# EAGLE design vibration_sensor_pcb (EAGLE 9.6.2)
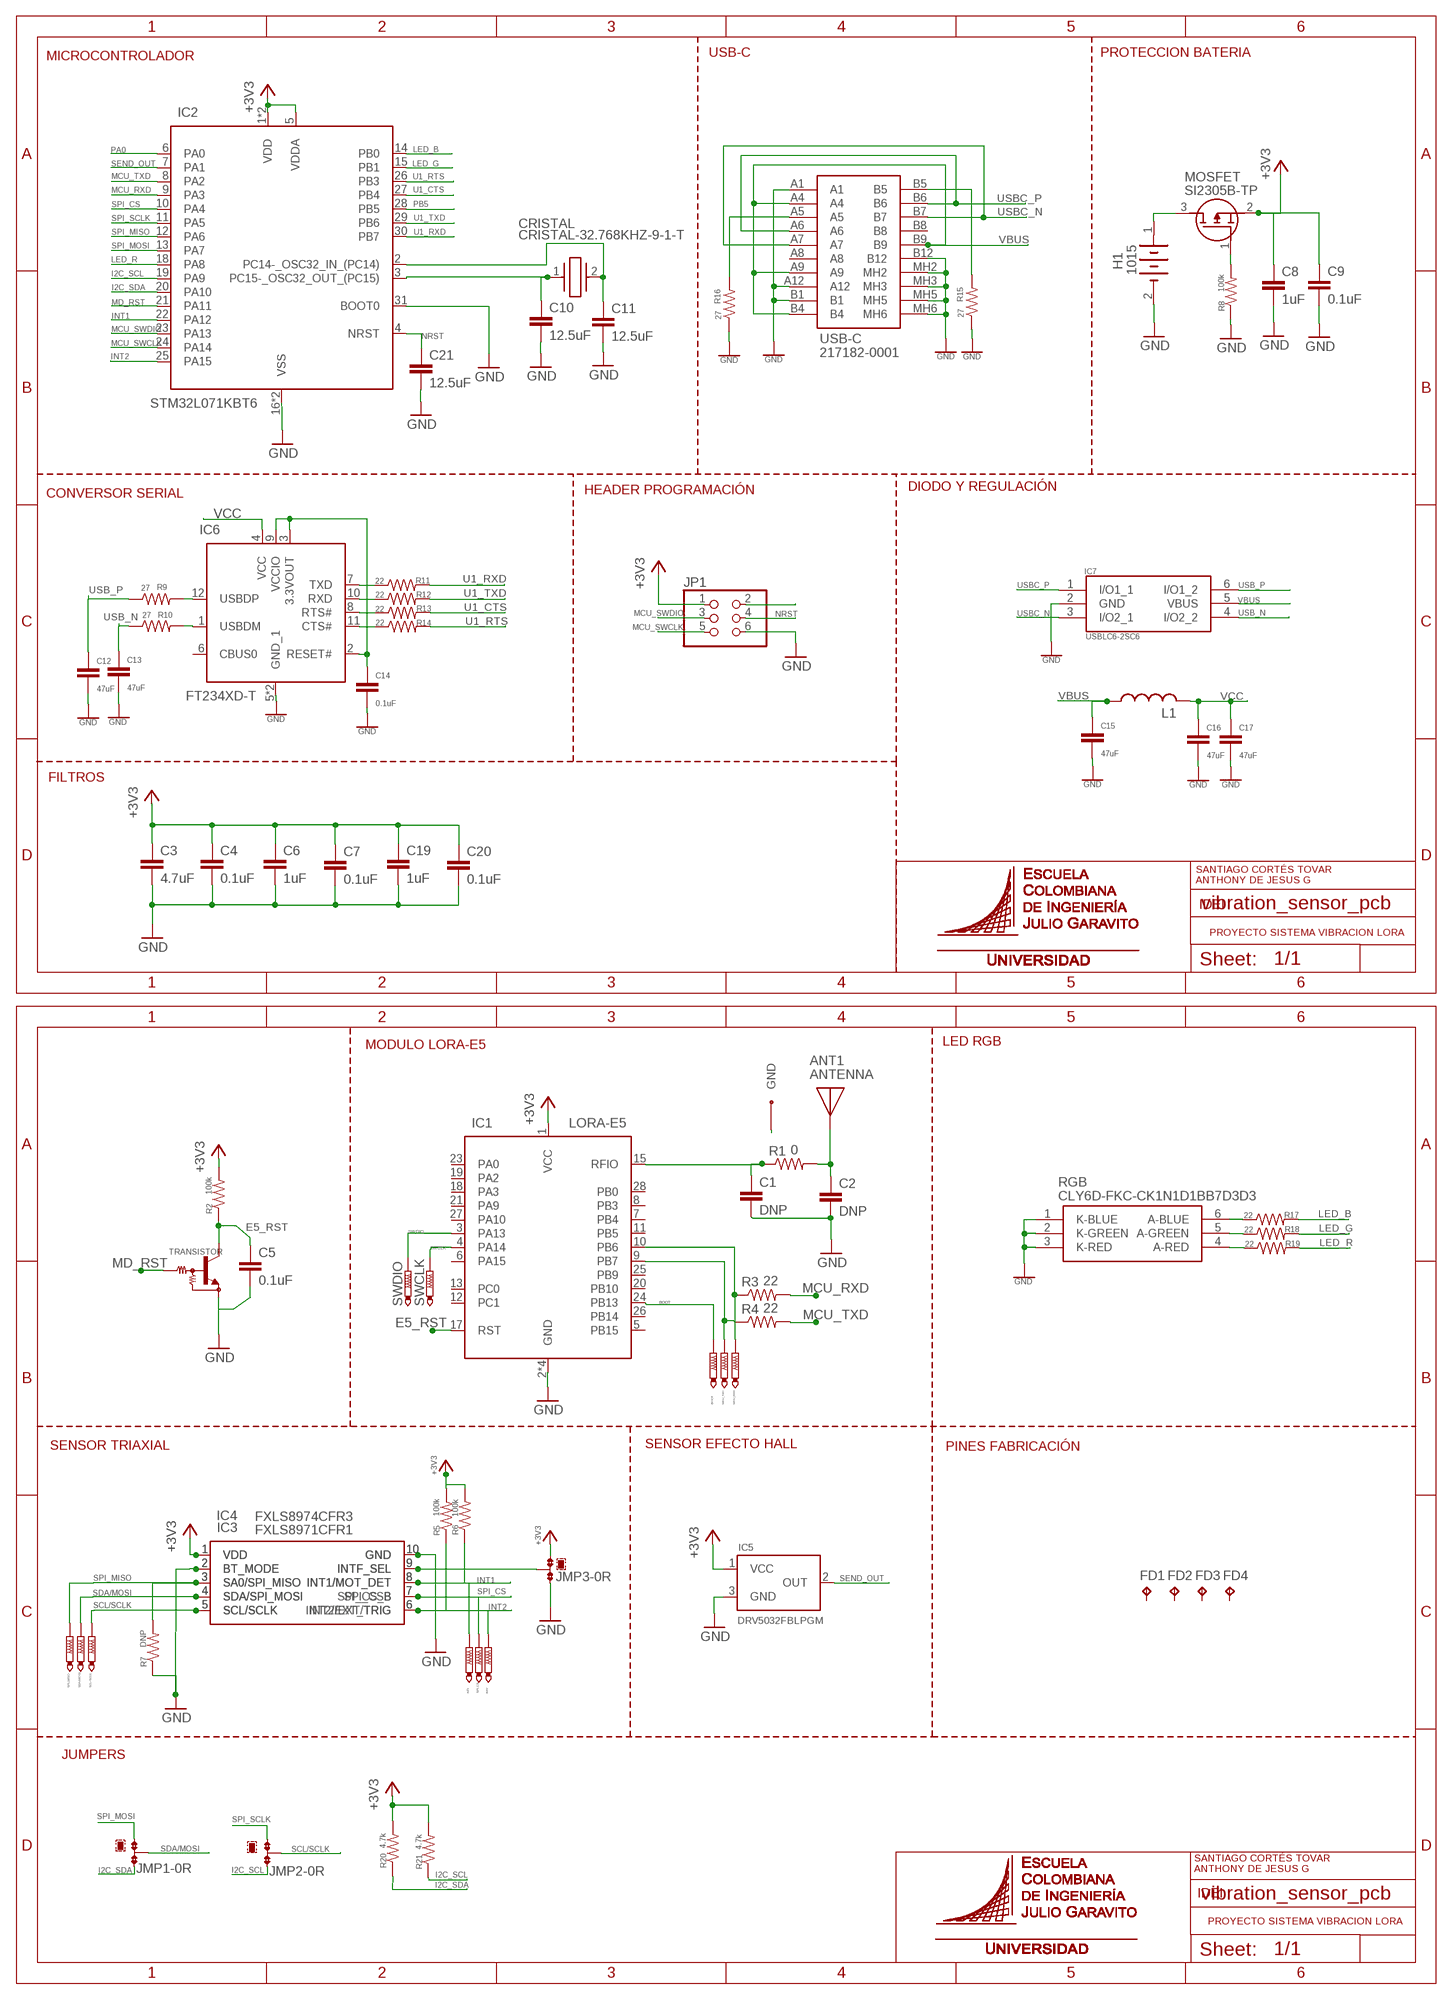
[diagram p0: schematic, sheet 1]

## Parts
ANT1  ANTENNA  [ANTENNA]
BOOT  PTR1TP11R  [TP11R]
C1  DNP  C-EUC0603  [C0603]
C2  DNP  C-EUC0603  [C0603]
C3  4.7uF  C-EUC0603  [C0603]
C4  0.1uF  C-EUC0603  [C0603]
C5  0.1uF  C-EUC0603  [C0603]
C6  1uF  C-EUC0603  [C0603]
C7  0.1uF  C-EUC0603  [C0603]
C8  1uF  C-EUC0603  [C0603]
C9  0.1uF  C-EUC0603  [C0603]
C10  12.5uF  C-EUC0603  [C0603]
C11  12.5uF  C-EUC0603  [C0603]
C12  47uF  C-EUC0603  [C0603]
C13  47uF  C-EUC0603  [C0603]
C14  0.1uF  C-EUC0603  [C0603]
C15  47uF  C-EUC0603  [C0603]
C16  47uF  C-EUC0603  [C0603]
C17  47uF  C-EUC0603  [C0603]
C19  1uF  C-EUC0603  [C0603]
C20  0.1uF  C-EUC0603  [C0603]
C21  12.5uF  C-EUC0603  [C0603]
CRISTAL  CRISTAL-32.768KHZ-9-1-T  [CRISTAL-32.768]
FD1  TPTP10R  [TP10R]
FD2  TPTP10R  [TP10R]
FD3  TPTP10R  [TP10R]
FD4  TPTP10R  [TP10R]
H1  1015  [1015]
IC1  LORA-E5  [LORA-E5]
IC2  STM32L071KBT6  [STM32L071KBT6]
IC3  FXLS8974CFR3  [FXLS8974CFR3]
IC4  FXLS8971CFR1  [FXLS8971CFR1]
IC5  DRV5032FBLPGM  [SOT23]
IC6  FT234XD-T  [SON45P300X300X80-13N]
IC7  USBLC6-2SC6  [SOT95P280X145-6N]
INT1  PTR1TP11R  [TP11R]
INT2  PTR1TP11R  [TP11R]
JMP1  0R-JUMPA  [A0R-JMP]
JMP2  0R-JUMPA  [A0R-JMP]
JMP3  0R-JUMPA  [A0R-JMP]
JP1  PINHD-2X3  [2X03]
L1  L-US  [C0805K]
MCU_RXD  PTR1TP11R  [TP11R]
MCU_TXD  PTR1TP11R  [TP11R]
MOSFET  SI2305B-TP  [SOT95P237X125-3N]
R1  0  R-US_R0603  [R0603]
R2  100k  R-US_R0603  [R0603]
R3  22  R-US_R0603  [R0603]
R4  22  R-US_R0603  [R0603]
R5  100k  R-US_R0603  [R0603]
R6  100k  R-US_R0603  [R0603]
R7  DNP  R-US_R0603  [R0603]
R8  100k  R-US_R0603  [R0603]
R9  27  R-US_R0603  [R0603]
R10  27  R-US_R0603  [R0603]
R11  22  R-US_R0603  [R0603]
R12  22  R-US_R0603  [R0603]
R13  22  R-US_R0603  [R0603]
R14  22  R-US_R0603  [R0603]
R15  27  R-US_R0603  [R0603]
R16  27  R-US_R0603  [R0603]
R17  22  R-US_R0603  [R0603]
R18  22  R-US_R0603  [R0603]
R19  22  R-US_R0603  [R0603]
R20  4.7k  R-US_R0603  [R0603]
R21  4.7k  R-US_R0603  [R0603]
RGB  CLY6D-FKC-CK1N1D1BB7D3D3  [PLCC6]
SCL/SCLK  PTR1TP11R  [TP11R]
SDA/MOSI  PTR1TP11R  [TP11R]
SPI_CS  PTR1TP11R  [TP11R]
SPI_MISO  PTR1TP11R  [TP11R]
SWCLK  PTR1TP11R  [TP11R]
SWDIO  PTR1TP11R  [TP11R]
TRANSISTOR  MUN2211T1-NPN_DRIVER-SC59-BEC  [SC59-BEC]
USB-C  217182-0001  [2171820001]

## Nets
+3V3: C3.1 C4.1 C6.1 C7.1 C8.1 C9.1 C19.1 C20.1 IC1.1(VCC) IC2.1(VDD) IC2.5(VDDA) IC2.17(VDD) IC3.1(VDD) IC4.1(VDD) IC5.1(VCC) JMP3.3 JP1.1 MOSFET.2(S) R2.2 R5.2 R6.2 R20.2 R21.2
A5: R16.2 USB-C.A5
ANT: ANT1.1(FEED) C2.1 R1.2
B5: R15.2 USB-C.B5
BOOT: BOOT.TP IC1.24(PB13)
E5_RST: C5.1 IC1.17(RST) R2.1 TRANSISTOR.C
GATE: MOSFET.1(G) R8.2
GND: ANT1.2(GND) ANT1.3(GND) C1.2 C2.2 C3.2 C4.2 C5.2 C6.2 C7.2 C8.2 C9.2 C10.2 C11.2 C12.2 C13.2 C14.2 C15.2 C16.2 C17.2 C19.2 C21.2 H1.2(-) IC1.2(GND) IC1.14(GND) IC1.16(GND) IC1.22(GND) IC2.16(VSS) IC2.31(BOOT0) IC2.32(VSS) IC3.2(BT_MODE) IC3.10(GND) IC4.2(BT_MODE) IC4.10(GND) IC5.3(GND) IC6.5(GND_1) IC6.13(GND_1) IC7.2(GND) JMP3.1 JP1.6 R7.1 R8.1 R15.1 R16.1 RGB.1(K-BLUE) RGB.2(K-GREEN) RGB.3(K-RED) TRANSISTOR.E USB-C.A1 USB-C.A12 USB-C.B1 USB-C.B12 USB-C.MH2 USB-C.MH3 USB-C.MH5 USB-C.MH6
GND1: C20.2
I2C_SCL: IC2.19(PA9) JMP2.3 R21.1
I2C_SDA: IC2.20(PA10) JMP1.3 R20.1
IN_MOSFET: H1.1(+) MOSFET.3(D)
INT1: IC2.22(PA12) IC3.8(INT1/MOT_DET) IC4.8(INT1/MOT_DET) INT1.TP R6.1
INT2: IC2.25(PA15) IC3.6(INT2/EXT_TRIG) IC4.6(INT2/EXT/TRIG) INT2.TP R5.1
INTF_SEL: IC3.9(INTF_SEL) IC4.9(INTF_SEL) JMP3.2
LED_B: IC2.14(PB0) R17.2
LED_G: IC2.15(PB1) R18.2
LED_R: IC2.18(PA8) R19.2
LORA_RXD: IC1.10(PB6) MCU_RXD.TP R3.1
LORA_TXD: IC1.9(PB7) MCU_TXD.TP R4.1
MCU_RXD: IC2.9(PA3) R3.2
MCU_SWCLK: IC2.24(PA14) JP1.5
MCU_SWDIO: IC2.23(PA13) JP1.3
MCU_TXD: IC2.8(PA2) R4.2
MD_RST: IC2.21(PA11) TRANSISTOR.B
N$2: JP1.2
NRST: C21.1 IC2.4(NRST) JP1.4
OSC32_IN: C11.1 CRISTAL.2 IC2.2(PC14-_OSC32_IN_(PC14))
OSC32_OUT: C10.1 CRISTAL.1 IC2.3(PC15-_OSC32_OUT_(PC15))
OUT_ANT: C1.1 IC1.15(RFIO) R1.1
PA0: IC2.6(PA0)
PB5: IC2.28(PB5)
R11: IC6.7(TXD) R11.1
R12: IC6.10(RXD) R12.1
R13: IC6.8(RTS#) R13.1
R14: IC6.11(CTS#) R14.1
R17: R17.1 RGB.6(A-BLUE)
R18: R18.1 RGB.5(A-GREEN)
R19: R19.1 RGB.4(A-RED)
RESET#: C14.1 IC6.2(RESET#) IC6.3(3.3VOUT) IC6.9(VCCIO)
SCL/SCLK: IC3.5(SCL/SCLK) IC4.5(SCL/SCLK) JMP2.2 SCL/SCLK.TP
SDA/MOSI: IC3.4(SDA/SPI_MOSI) IC4.4(SDA/SPI_MOSI) JMP1.2 SDA/MOSI.TP
SEND_OUT: IC2.7(PA1) IC5.2(OUT)
SPI_CS: IC2.10(PA4) IC3.7(SPI_CS_B) IC4.7(SPI_CSB) SPI_CS.TP
SPI_MISO: IC2.12(PA6) IC3.3(SA0/SPI_MISO) IC4.3(SA0/SPI_MISO) R7.2 SPI_MISO.TP
SPI_MOSI: IC2.13(PA7) JMP1.1
SPI_SCLK: IC2.11(PA5) JMP2.1
SWCLK: IC1.4(PA14) SWCLK.TP
SWDIO: IC1.3(PA13) SWDIO.TP
U1_CTS: IC2.27(PB4) R13.2
U1_RTS: IC2.26(PB3) R14.2
U1_RXD: IC2.30(PB7) R11.2
U1_TXD: IC2.29(PB6) R12.2
USB_N: C13.1 IC7.4(I/O2_2) R10.1
USB_P: C12.1 IC7.6(I/O1_2) R9.1
USBC_N: IC7.3(I/O2_1) USB-C.A7 USB-C.B7
USBC_P: IC7.1(I/O1_1) USB-C.A6 USB-C.B6
USBDM: IC6.1(USBDM) R10.2
USBDP: IC6.12(USBDP) R9.2
VBUS: C15.1 IC7.5(VBUS) L1.1 USB-C.A4 USB-C.A9 USB-C.B4 USB-C.B9
VCC: C16.1 C17.1 IC6.4(VCC) L1.2
Unconnected: FD1.TP FD2.TP FD3.TP FD4.TP IC1.5(PB15) IC1.6(PA15) IC1.7(PB4) IC1.8(PB3) IC1.11(PB5) IC1.12(PC1) IC1.13(PC0) IC1.18(PA3) IC1.19(PA2) IC1.20(PB10) IC1.21(PA9) IC1.23(PA0) IC1.25(PB9) IC1.26(PB14) IC1.27(PA10) IC1.28(PB0) IC6.6(CBUS0) USB-C.A8 USB-C.B8

## Notes on the sheet
- MICROCONTROLADOR | USB-C | PROTECCION BATERIA
- HEADER PROGRAMACIÓN | DIODO Y REGULACIÓN
- CONVERSOR SERIAL
- FILTROS
- SANTIAGO CORTÉS TOVAR
  ANTHONY DE JESUS G
- IDEI
- PROYECTO SISTEMA VIBRACION LORA
- MODULO LORA-E5 | LED RGB
- SENSOR TRIAXIAL | SENSOR EFECTO HALL | PINES FABRICACIÓN
- JUMPERS
- SANTIAGO CORTÉS TOVAR
  ANTHONY DE JESUS G
- IDEI
- PROYECTO SISTEMA VIBRACION LORA

## Library data of the parts
ANT1 = SamacSys_Parts:ANTENNA: PULSE LARSEN ANTENNAS - W3211 - CERAMIC ON GROUND ANTENNA, 902-928MHZ Source: Datasheet; DESCRIPTION: PULSE LARSEN ANTENNAS - W3211 - CERAMIC ON GROUND ANTENNA, 902-928MHZ; HEIGHT: 5mm; MANUFACTURER_NAME: Pulse Electronics; MANUFACTURER_PART_NUMBER: W3211; MOUSER_PART_NUMBER: 673-W3211; MOUSER_PRICE-STOCK: https://www.mouser.co.uk/ProductDetail/PulseLarsen-Antennas/W3211?qs=l7cgNqFNU1g5WBF3n%252BWoMg%3D%3D
BOOT INT1 INT2 MCU_RXD MCU_TXD SCL/SCLK SDA/MOSI SPI_CS SPI_MISO SWCLK SWDIO = testpad:PTR1: TEST PIN
C1-C17 C19-C21 = rcl:C-EU: CAPACITOR, European symbol; SPICEPREFIX: C
CRISTAL = SamacSys_Parts:CRISTAL-32.768KHZ-9-1-T: ABRACON - ABS06-32.768KHZ-9-1-T - CRYSTAL, 32.768KHZ, 9PF, 2 X 1.2MM Source: Datasheet <https://abracon.com/Resonators/ABS06.pdf>; DESCRIPTION: ABRACON - ABS06-32.768KHZ-9-1-T - CRYSTAL, 32.768KHZ, 9PF, 2 X 1.2MM; HEIGHT: 0.6mm; MANUFACTURER_NAME: ABRACON; MANUFACTURER_PART_NUMBER: ABS06-32.768KHZ-9-1-T; MOUSER_PART_NUMBER: 815-ABS06-32.7K-9-T; MOUSER_PRICE-STOCK: https://www.mouser.co.uk/ProductDetail/ABRACON/ABS06-32.768KHZ-9-1-T?qs=3LVMET7lfiNjL9rrGxo%252ByA%3D%3D
FD1-FD4 = testpad:TP: Test pad
H1 = SamacSys_Parts:1015: Cylindrical Battery Contacts, Clips, Holders & Springs AA PC Battery HOLDER Source: Datasheet <https://componentsearchengine.com/Datasheets/1/1015.pdf>; DESCRIPTION: Cylindrical Battery Contacts, Clips, Holders & Springs AA PC Battery HOLDER; HEIGHT: mm; MANUFACTURER_NAME: Keystone Electronics; MANUFACTURER_PART_NUMBER: 1015; MOUSER_PART_NUMBER: 534-1015; MOUSER_PRICE-STOCK: https://www.mouser.co.uk/ProductDetail/Keystone-Electronics/1015?qs=73q%2FgRcW4F2OhJTPPQWZpA%3D%3D
IC1 = SamacSys_Parts:LORA-E5: Sub-GHz Modules LoRa-E5 Wireless Module LoRa-E5 has a 28-pin SMD package Source: Datasheet <https://files.seeedstudio.com/products/317990687/res/LoRa-E5 module datasheet_V1.0.pdf>; DESCRIPTION: Sub-GHz Modules LoRa-E5 Wireless Module LoRa-E5 has a 28-pin SMD package; HEIGHT: 2.5mm; MANUFACTURER_NAME: Seeed Studio; MANUFACTURER_PART_NUMBER: 317990687; MOUSER_PART_NUMBER: 713-317990687; MOUSER_PRICE-STOCK: https://www.mouser.co.uk/ProductDetail/Seeed-Studio/317990687?qs=hd1VzrDQEGhZOj13wvzSLA%3D%3D
IC2 = SamacSys_Parts:STM32L071KBT6: MCU 32-bit STM32 ARM Cortex M0+ RISC 128KB Flash 2.5V/3.3V 32-Pin LQFP Tray Source: Datasheet <https://www.arrow.com/en/products/stm32l071kbt6/stmicroelectronics>; DESCRIPTION: MCU 32-bit STM32 ARM Cortex M0+ RISC 128KB Flash 2.5V/3.3V 32-Pin LQFP Tray; HEIGHT: 1.6mm; MANUFACTURER_NAME: STMicroelectronics; MANUFACTURER_PART_NUMBER: STM32L071KBT6; MOUSER_PART_NUMBER: 511-STM32L071KBT6; MOUSER_PRICE-STOCK: https://www.mouser.co.uk/ProductDetail/STMicroelectronics/STM32L071KBT6?qs=mKNKSX85ZJf5FR8Umx1PEQ%3D%3D
IC3 = SamacSys_Parts:FXLS8974CFR3: Accelerometer X, Y, Z Axis +/-2g, 4g, 8g, 16g 1.6kHz 10-DFN (2x2) Source: Datasheet <https://www.nxp.com/docs/en/data-sheet/FXLS8974CF.pdf>; DESCRIPTION: Accelerometer X, Y, Z Axis +/-2g, 4g, 8g, 16g 1.6kHz 10-DFN (2x2); HEIGHT: 1mm; MANUFACTURER_NAME: NXP; MANUFACTURER_PART_NUMBER: FXLS8974CFR3; MOUSER_PART_NUMBER: 771-FXLS8974CFR3; MOUSER_PRICE-STOCK: https://www.mouser.co.uk/ProductDetail/NXP-Semiconductors/FXLS8974CFR3?qs=QNEnbhJQKva4g7R74%252BwIOg%3D%3D
IC4 = SamacSys_Parts:FXLS8971CFR1: 3-Axis Low-g Accelerometer FXLS8971CF is available in a 3 mm x 3 mm x 1.25 mm 12-pin QFN package with 0.65 mm pitch and wettable flanks Source: Datasheet <https://www.nxp.com/docs/en/data-sheet/FXLS8971CF.pdf>; DESCRIPTION: 3-Axis Low-g Accelerometer FXLS8971CF is available in a 3 mm x 3 mm x 1.25 mm 12-pin QFN package with 0.65 mm pitch and wettable flanks; HEIGHT: 1.3mm; MANUFACTURER_NAME: NXP; MANUFACTURER_PART_NUMBER: FXLS8971CF
IC5 = transistor:DRV5032FBLPGM
IC6 = SamacSys_Parts:FT234XD-T: USB Interface IC USB to Basic Serial UART IC Source: Datasheet <https://datasheet.lcsc.com/szlcsc/1811190128_Future-Designs-FT234XD-T_C89606.pdf>; DESCRIPTION: USB Interface IC USB to Basic Serial UART IC; HEIGHT: 0.8mm; MANUFACTURER_NAME: FTDI(Future Designs); MANUFACTURER_PART_NUMBER: FT234XD-T
IC7 = SamacSys_Parts:USBLC6-2SC6: TVS Diode Array Uni-Directional USBLC6-2SC6 17V, SOT-23 6-Pin Source: Datasheet <http://www.st.com/st-web-ui/static/active/en/resource/technical/document/datasheet/CD00050750.pdf>; DESCRIPTION: TVS Diode Array Uni-Directional USBLC6-2SC6 17V, SOT-23 6-Pin; HEIGHT: 1.45mm; MANUFACTURER_NAME: STMicroelectronics; MANUFACTURER_PART_NUMBER: USBLC6-2SC6; MOUSER_PART_NUMBER: 511-USBLC6-2SC6; MOUSER_PRICE-STOCK: https://www.mouser.co.uk/ProductDetail/STMicroelectronics/USBLC6-2SC6?qs=po45yt2pPpu%2FhNIlwQdTlg%3D%3D
JMP1-JMP3 = jump-0r-smd:0R-JUMP: SMD 0R 0805 Jumper
JP1 = pinhead:PINHD-2X3: PIN HEADER
L1 = rcl:L-US: INDUCTOR, American symbol
MOSFET = SamacSys_Parts:SI2305B-TP: P-Channel 20 V 4.2A (Tj) 1.4W Surface Mount SOT-23 Source: Datasheet <https://www.mccsemi.com/pdf/Products/SI2305B(SOT-23).pdf>; DESCRIPTION: P-Channel 20 V 4.2A (Tj) 1.4W Surface Mount SOT-23; HEIGHT: 1.25mm; MANUFACTURER_NAME: MCC; MANUFACTURER_PART_NUMBER: SI2305B-TP; MOUSER_PART_NUMBER: 833-SI2305B-TP; MOUSER_PRICE-STOCK: https://www.mouser.co.uk/ProductDetail/Micro-Commercial-Components-MCC/SI2305B-TP?qs=55YtniHzbhCFulR5a8ppxA%3D%3D
R1-R21 = rcl:R-US_: RESISTOR, American symbol; SPICEPREFIX: R
RGB = SamacSys_Parts:CLY6D-FKC-CK1N1D1BB7D3D3: LED Blue/Green/Red 6-Pin PLCC T/R Cree CLY6D-FKC-CK1N1D1BB7D3D3, CLY6D-FKC Series RGB LED, 480 (Blue) nm, 540 (Green) nm, 624 (Red) nm PLCC 6 Source: Datasheet <http://www.cree.com/led-components/media/documents/ds-1321-CLY6D-FKC.pdf>; DESCRIPTION: LED Blue/Green/Red 6-Pin PLCC T/R Cree CLY6D-FKC-CK1N1D1BB7D3D3, CLY6D-FKC Series RGB LED, 480 (Blue) nm, 540 (Green) nm, 624 (Red) nm PLCC 6; HEIGHT: mm; MANUFACTURER_NAME: CREE LED; MANUFACTURER_PART_NUMBER: CLY6D-FKC-CK1N1D1BB7D3D3; MOUSER_PART_NUMBER: 941-CLY6DFKCCK1N1D1B; MOUSER_PRICE-STOCK: https://www.mouser.co.uk/ProductDetail/Cree-LED/CLY6D-FKC-CK1N1D1BB7D3D3?qs=3ZbGupGMFUcwV8ee%2FC0TnQ%3D%3D
TRANSISTOR = transistor-neu-to92:*-NPN_DRIVER-: NPN Bias Resistor Transistor; SPICEPREFIX: J
USB-C = SamacSys_Parts:217182-0001: USB-C,VERT SMT,16P 6.40mm HT Source: Datasheet <https://www.molex.com/pdm_docs/sd/2171820001_sd.pdf>; DESCRIPTION: USB-C,VERT SMT,16P 6.40mm HT; HEIGHT: 7.6mm; MANUFACTURER_NAME: Molex; MANUFACTURER_PART_NUMBER: 217182-0001; MOUSER_PART_NUMBER: 538-217182-0001; MOUSER_PRICE-STOCK: https://www.mouser.co.uk/ProductDetail/Molex/217182-0001?qs=DRkmTr78QATos3F5kgk4kw%3D%3D

## Board
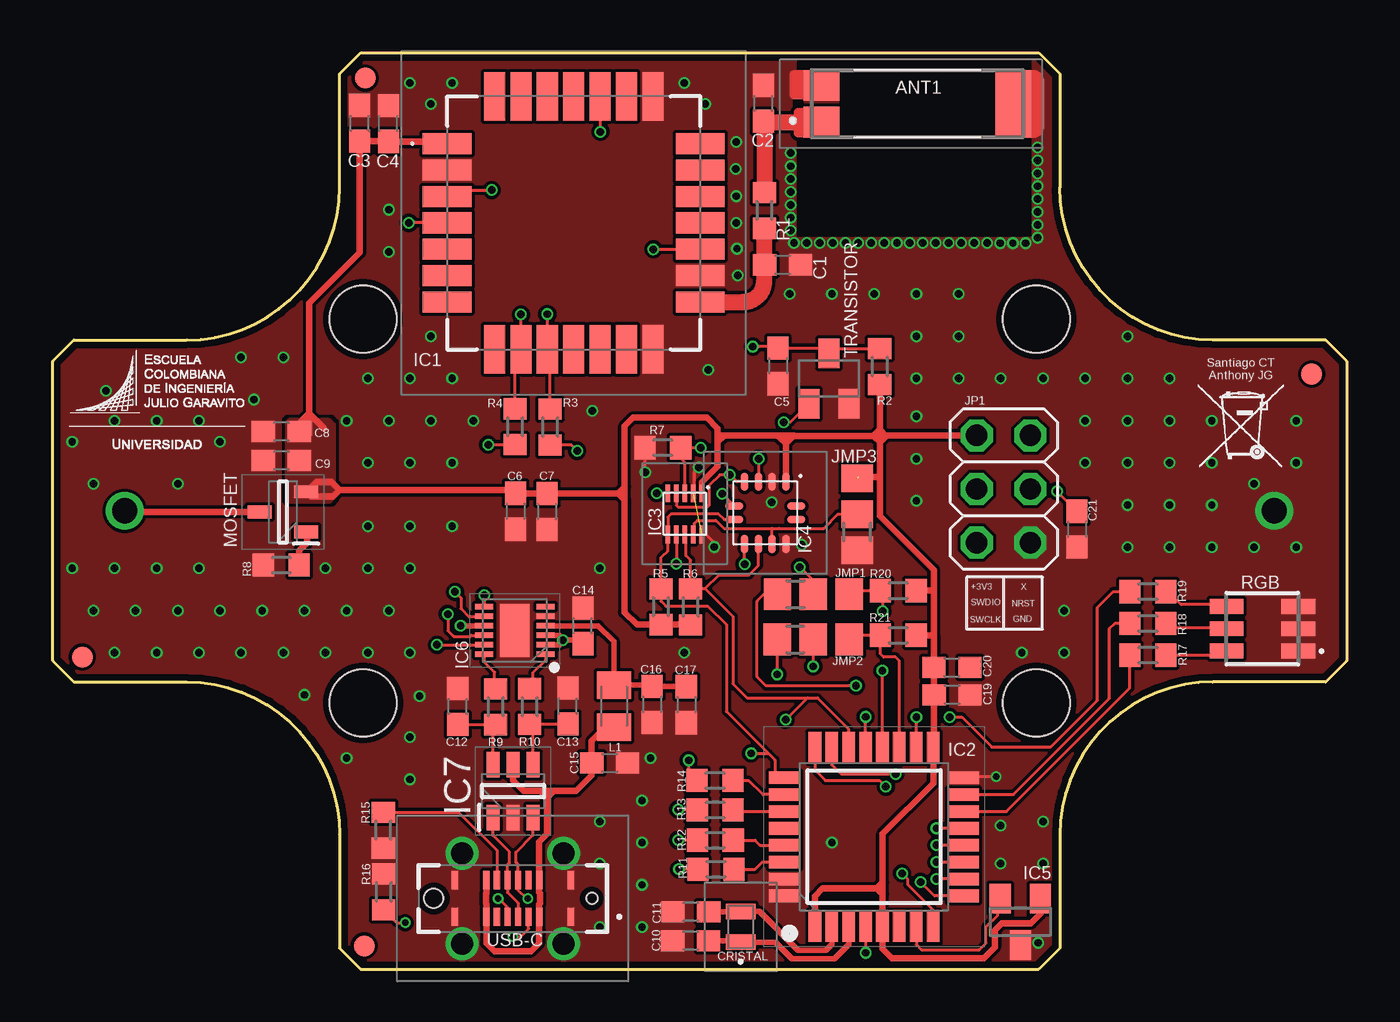
[diagram p1: board, top side]
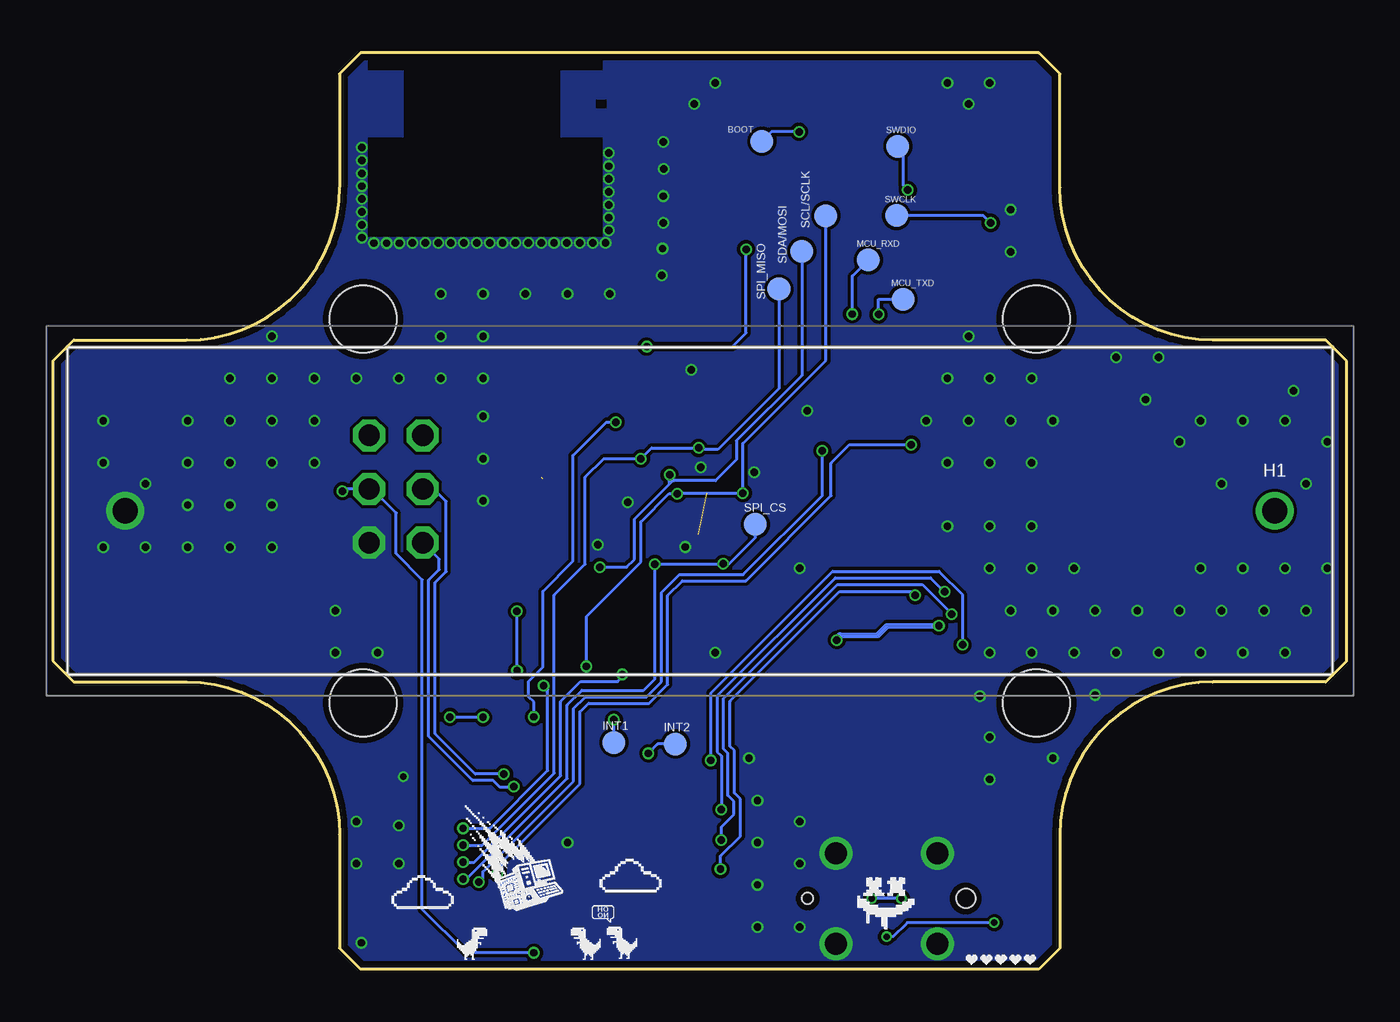
[diagram p2: board, bottom side, seen from below]

Size 61.32 x 43.43 mm. Coordinates in mm from the lower left corner, seen from the top.
Outline: 14.59,43.43 46.73,43.43 47.73,42.43 47.73,37.06 arc90 54.97,29.82 60.32,29.82 61.32,28.82 61.32,14.61 60.32,13.61 54.97,13.61 arc90 47.73,6.38 47.73,1 46.73,0 14.59,0 13.59,1 13.59,6.38 arc90 6.35,13.61 1,13.61 0,14.61 0,28.82 1,29.82 6.35,29.82 arc90 13.59,37.06 13.59,42.43 14.59,43.43
Copper layers (1*16): Top 0.035mm / dielectric 1.5mm / Bottom 0.035mm
Design rules "PCBWay_2L_152um-Track": minimum track width 6mil, minimum drill 0.3mm, track to track 6mil, track to pad 6mil, pad to pad 6mil, via to via 6mil, smd to smd 0mil, copper to edge 0.3mm, drill to drill 10mil, minimum pad ring 6mil, minimum via ring 0.1mm, stop-mask expansion 2mil, vias tented up to drill 0.45mm, thermal gap 0.2mm
Holes 3.17 mm at 14.71,30.81 14.71,12.62 46.61,30.81 46.61,12.62

### Footprints (pad centres in the part's own frame; a part is rotated, then mirrored left to right if it is on the bottom)
ANTENNA = smd 1.7 x 1.45: 1 -4.55,-0.875; 2 -4.55,0.875 | smd 1.7 x 3.2: 3 4.55,0
TP11R = smd 1.1 x 1.1: TP 0,0
C0603 = smd 1.1 x 1: 1 -0.85,0; 2 0.85,0
CRISTAL-32.768 = smd 0.75 x 1.4: 1 -0.725,0; 2 0.725,0
TP10R = smd 1 x 1: TP 0,0
1015 = drill 1.19 pad 1.785: 1 0,0; 2 54.48,0
LORA-E5 = smd 2.3 x 1: 1 -6,3.75; 2 -6,2.5; 3 -6,1.25; 4 -6,0; 5 -6,-1.25; 6 -6,-2.5; 7 -6,-3.75; 15 6,-3.75; 16 6,-2.5; 17 6,-1.25; 18 6,0; 19 6,1.25; 20 6,2.5; 21 6,3.75 | smd 1 x 2.3: 8 -3.75,-6; 9 -2.5,-6; 10 -1.25,-6; 11 0,-6; 12 1.25,-6; 13 2.5,-6; 14 3.75,-6; 22 3.75,6; 23 2.5,6; 24 1.25,6; 25 0,6; 26 -1.25,6; 27 -2.5,6; 28 -3.75,6
STM32L071KBT6 = smd 1.475 x 0.6: 1 -4.238,2.8; 2 -4.238,2; 3 -4.238,1.2; 4 -4.238,0.4; 5 -4.238,-0.4; 6 -4.238,-1.2; 7 -4.238,-2; 8 -4.238,-2.8; 17 4.238,-2.8; 18 4.238,-2; 19 4.238,-1.2; 20 4.238,-0.4; 21 4.238,0.4; 22 4.238,1.2; 23 4.238,2; 24 4.238,2.8 | smd 0.6 x 1.475: 9 -2.8,-4.238; 10 -2,-4.238; 11 -1.2,-4.238; 12 -0.4,-4.238; 13 0.4,-4.238; 14 1.2,-4.238; 15 2,-4.238; 16 2.8,-4.238; 25 2.8,4.238; 26 2,4.238; 27 1.2,4.238; 28 0.4,4.238; 29 -0.4,4.238; 30 -1.2,4.238; 31 -2,4.238; 32 -2.8,4.238
FXLS8974CFR3 = smd 0.85 x 0.225: 1 -0.975,0.8; 2 -0.975,0.4; 3 -0.975,0; 4 -0.975,-0.4; 5 -0.975,-0.8; 6 0.975,-0.8; 7 0.975,-0.4; 8 0.975,0; 9 0.975,0.4; 10 0.975,0.8
FXLS8971CFR1 = smd 0.85 x 0.35: 1 -1.475,0.975; 2 -1.475,0.325; 3 -1.475,-0.325; 4 -1.475,-0.975; 7 1.475,-0.975; 8 1.475,-0.325; 9 1.475,0.325; 10 1.475,0.975 | smd 0.35 x 0.85: 5 -0.325,-1.475; 6 0.325,-1.475; 11 0.325,1.475; 12 -0.325,1.475
SOT23 = smd 1 x 1.4: 1 -0.95,-1.1; 2 0.95,-1.1; 3 0,1.1
SON45P300X300X80-13N = smd 0.85 x 0.25: 1 -1.45,1.125; 2 -1.45,0.675; 3 -1.45,0.225; 4 -1.45,-0.225; 5 -1.45,-0.675; 6 -1.45,-1.125; 7 1.45,-1.125; 8 1.45,-0.675; 9 1.45,-0.225; 10 1.45,0.225; 11 1.45,0.675; 12 1.45,1.125 | smd 1.4 x 2.5: 13 0,0
SOT95P280X145-6N = smd 1.2 x 0.6: 1 -1.25,0.95; 2 -1.25,0; 3 -1.25,-0.95; 4 1.25,-0.95; 5 1.25,0; 6 1.25,0.95
A0R-JMP = smd 1.5 x 1.3: 1 0,1.7; 2 0,0; 3 0,-1.7
2X03 = drill 1.016 octagon: 1 -2.54,-1.27; 2 -2.54,1.27; 3 0,-1.27; 4 0,1.27; 5 2.54,-1.27; 6 2.54,1.27
C0805K = smd 1.3 x 1.6: 1 -1,0; 2 1,0
SOT95P237X125-3N = smd 1.15 x 0.6: 1 -1.1,0.95; 2 -1.1,-0.95; 3 1.1,0
R0603 = smd 1 x 1.1: 1 -0.85,0; 2 0.85,0
PLCC6 = smd 1.6 x 0.7: 1 -1.7,1.05; 2 -1.7,0; 3 -1.7,-1.05; 4 1.7,-1.05; 5 1.7,0; 6 1.7,1.05
SC59-BEC = smd 1 x 1.4: B -0.95,-1.2; C 0,1.2; E 0.95,-1.2
2171820001 = smd 0.3 x 0.87: A1 -2.75,0.865; A4 -1.25,0.865; A5 -0.75,0.865; A6 -0.25,0.865; A7 0.25,0.865; A8 0.75,0.865; A9 1.25,0.865; A12 2.75,0.865; B1 2.75,-0.865; B4 1.25,-0.865; B5 0.75,-0.865; B6 0.25,-0.865; B7 -0.25,-0.865; B8 -0.75,-0.865; B9 -1.25,-0.865; B12 -2.75,-0.865 | drill 1.04 pad 1.56: MH2 -2.4,-2.15; MH3 2.4,-2.15; MH5 2.4,2.15; MH6 -2.4,2.15 | hole 0.52: -3.75,0 | hole 0.89: 3.75,0

### Placement (x,y rotation side)
ANT1  40.97,41.02 0 top
BOOT  27.72,39.24 0 bottom
C1  34.58,33.38 0 top
C2  33.67,41.03 90 top
C3  14.55,40.09 90 top
C4  15.91,40.08 90 top
C5  34.36,28.59 270 top
C6  21.92,21.71 270 top
C7  23.41,21.69 270 top
C8  10.83,25.49 180 top
C9  10.84,24.11 180 top
C10  30.23,1.35 180 top
C11  30.24,2.72 180 top
C12  19.19,12.45 90 top
C13  24.41,12.48 90 top
C14  25.12,16.27 90 top
C15  26.39,9.77 0 top
C16  28.39,12.55 270 top
C17  30.02,12.54 270 top
C19  42.61,13.01 0 top
C20  42.6,14.3 0 top
C21  48.52,20.86 270 top
CRISTAL  32.6,2.01 90 top
FD1  14.81,42.23 0 top
FD2  14.76,1.1 0 top
FD3  1.4,14.79 0 top
FD4  59.65,28.21 0 top
H1  3.41,21.73 180 bottom
IC1  24.69,35.37 0 top
IC2  38.92,6.28 90 top
IC3  29.95,21.58 270 top
IC4  33.76,21.63 270 top
IC5  45.84,2.26 180 top
IC6  21.89,16.05 180 top
IC7  21.81,8.44 90 top
INT1  34.72,10.74 0 bottom
INT2  31.81,10.67 0 bottom
JMP1  36.04,17.78 90 top
JMP2  36.03,15.63 90 top
JMP3  38.12,21.57 180 top
JP1  45.05,22.76 270 top
L1  26.6,12.47 90 top
MCU_RXD  22.67,33.62 0 bottom
MCU_TXD  21.03,31.75 0 bottom
MOSFET  10.91,21.67 180 top
R1  33.72,35.96 90 top
R2  39.18,28.56 270 top
R3  23.57,25.69 270 top
R4  21.91,25.71 270 top
R5  28.82,17.18 270 top
R6  30.22,17.17 270 top
R7  28.91,24.72 0 top
R8  10.83,19.16 0 top
R9  20.99,12.44 90 top
R10  22.6,12.45 90 top
R11  31.42,4.74 0 top
R12  31.39,6.12 0 top
R13  31.39,7.55 0 top
R14  31.38,8.95 0 top
R15  15.66,6.59 90 top
R16  15.68,3.67 270 top
R17  51.89,14.88 180 top
R18  51.89,16.39 180 top
R19  51.89,17.89 180 top
R20  40.06,17.94 0 top
R21  40.06,15.83 0 top
RGB  57.32,16.14 180 top
SCL/SCLK  24.68,35.71 0 bottom
SDA/MOSI  25.82,34.03 0 bottom
SPI_CS  28.02,21.08 0 bottom
SPI_MISO  26.9,32.24 0 bottom
SWCLK  21.34,35.72 0 bottom
SWDIO  21.28,39 0 bottom
TRANSISTOR  36.77,28 0 top
USB-C  21.8,3.35 180 top

### Tracks (layer width: path | path; a pad name or v marks a point on that pad's centre or on a via)
+3V3  (1 unrouted)
  Top 0.152: 39.19,27.76 39.18,27.75 R2.2
  Top 0.254: 12.1,25.49 C8.1 11.68,25.89 12.15,26.36 | 12.15,26.36 12.87,25.64 12.87,25.61 12.15,26.32 12.15,26.36 | IC3.1 30.75,23.07 31.5,23.83 | 34.42,25.23 34.48,25.29 | 39.53,25.3 39.48,25.3 39.19,25.59 38.88,25.28 39.19,24.96 39.53,25.3 | 39.53,25.3
  Top 0.305: IC1.1 18.58,39.23 C4.1 C3.1 14.55,33.97 12.15,31.57 12.15,26.36 12.15,25.34 | 13.6,22.7 13.29,22.39 12.24,22.39 MOSFET.2 12.47,23.09 13.21,23.09 13.59,22.7 13.6,22.7 | 34.74,24.91 IC4.1 | 31.5,25.29 31.5,24.98 | 31.5,24.98 31.5,23.83 | 31.5,25.29 31.5,25.63 30.99,26.14 27.5,26.14 27.1,25.74 27.1,22.86 | 34.74,24.91 34.42,25.23 | 31.82,25.29 34.48,25.29 34.74,25.29 | 31.82,25.29 31.5,25.29 | 31.5,24.98 31.82,25.29 | 34.74,25.29 35.11,25.29 35.1,25.28 | 35.1,25.28 38.88,25.28 | 39.19,27.76 39.19,25.59 39.19,25.3 | 34.74,24.91 35.1,25.28 | 34.74,24.91 34.74,25.29 | 41.74,17.93 41.74,15.83 R21.2 41.74,15.83 41.74,14.31 C20.1 41.75,13.02 C19.1 41.76,10.57 IC2.17 41.73,10.5 41.73,8.82 39.31,6.41 39.31,4.11 | 41.74,17.93 41.74,18.92 39.19,21.48 39.19,23.32 | 39.19,25.3 39.19,24.96 39.19,23.32 | 39.31,3.56 IC2.5 39.31,0.97 39.76,0.53 44.12,0.53 44.64,1.04 44.64,1.84 44.98,2.18 46.35,2.18 46.79,2.62 IC5.1 | 39.31,3.56 39.31,4.11 | IC2.1 36.11,3.47 36.48,3.83 39.04,3.83 | 39.04,3.83 39.31,3.56 | 39.04,3.83 39.31,4.11 | 39.19,25.3 39.53,25.3 JP1.1 | R20.2 41.73,17.94 41.74,17.93 | 38.17,23.32 39.19,23.32 | 13.6,22.7 21.78,22.7 C6.1 23.4,22.56 C7.1 26.78,22.54 | 26.78,22.54 27.1,22.86 | 26.78,22.54 27.08,22.23 | 27.08,22.23 27.08,16.92 27.67,16.33 R5.2 R6.2 | 27.08,22.23 27.1,22.25 27.1,22.86
  pour Top (no thermals): 11.24,22.13 11.07,22.29 11.07,25.94 11.21,26.07 13.11,26.07 13.34,25.84 13.34,22.34 13.14,22.13
A5  (via drill 0.3)
  Top 0.152: R16.2 16.29,2.21 v16.7,2.21 | v21.8,1.54 22.17,1.54 22.55,1.92 USB-C.A5
  Bottom 0.152: v16.7,2.21 18.98,2.21 20.82,2.21 21.49,1.54 v21.8,1.54
ANT
  Top 0.406: ANT1.1 35.9,39.62 35.3,39.62 35.3,40.61 35.6,40.61 35.6,39.88 36.16,39.88 ANT1.1
  Top 0.76: R1.2 33.72,40.14 C2.1 33.72,40.14 ANT1.1
B5
  Top 0.152: R15.2 19.23,7.44 21.05,5.63 USB-C.B5
BOOT  (via drill 0.35)
  Top 0.152: IC1.24 25.94,39.71 v25.95,39.69
  Bottom 0.152: v25.95,39.69 27.26,39.69 BOOT.TP
E5_RST  (via drill 0.35)
  Top 0.152: v28.46,34.12 IC1.17 | v33.17,29.51 34.29,29.51 C5.1 36.53,29.44 TRANSISTOR.C 36.99,29.41 R2.1
  Bottom 0.152: v33.17,29.51 29.1,29.51 28.46,30.15 v28.46,34.12
GATE
  Top 0.305: R8.2 11.68,19.84 12.05,20.21 12.05,20.68 MOSFET.1
GND  (via drill 0.3, 0.35)  (1 unrouted)
  Top 0.152: v28.07,23.56 28.07,24.7 R7.1 | v30.6,23.79 30.39,23.58 30.39,22.6 IC3.2 | IC2.16 43.2,9.13 v44.7,9.13 | IC3.10 30.96,20.61 31.34,20.22 v31.34,20.01
  Top 0.406: ANT1.2 35.95,41.42 35.11,41.42 35.11,42.4 35.13,42.41 35.59,42.41 35.59,41.68 35.57,41.66 35.3,41.66 35.3,42.08 36.23,42.08 ANT1.2
  Top 1.016: 46.47,42.1 46.47,39.91
  other vias: 46.69,1.25 34.07,22.13 35.48,20.12 36.95,34.42 42.92,32 40.92,32 38.92,32 36.92,32 34.92,32 40.92,30 42.92,30 40.92,28 42.92,28 44.92,28 40.92,26.2 46.92,28 48.92,28 50.92,28 52.92,28 52.92,26 50.92,26 48.92,26 48.92,24 50.92,24 52.92,24 11.92,13 13.92,10 25.92,5 27.92,6 28.32,10 27.92,2 36.92,6 40.92,24.2 40.92,22.2 50.92,30 32.45,32.88 32.42,34.15 32.38,35.38 32.38,36.64 32.36,37.92 32.39,39.21 30.92,41 29.92,42 18.92,42 17.92,41 58.92,20 54.92,24 46.93,5 2.92,15 8.92,15 14.92,15 14.92,21 2.52,27.42 9.53,27 13.92,26 25.57,26.46 47.92,15 50.92,22 52.92,22 54.92,22 54.92,20 52.92,20 50.92,20 56.92,20 54.92,26 58.92,26 58.92,24 56.92,23 47.92,17 45.92,15 44.92,5 44.92,6.81 46.93,7 27.92,4 25.92,2 25.92,7 27.92,8 29.92,15 25.92,19 12.92,15 10.92,15 6.92,15 4.92,15 3.92,17 1.92,17 5.92,17 7.92,17 9.92,17 11.92,17 13.92,17 15.92,17 16.92,15 17.38,12.94 16.92,11 16.92,9 16.92,19 14.92,19 12.92,19 16.92,21 18.92,21 14.92,24 16.92,24 18.92,24 15.92,26 17.92,26 19.92,26 2.92,19 0.92,19 4.92,19 6.92,19 1.92,23 5.92,23 0.92,25 7.92,25 2.92,26 4.92,26 6.92,26 8.92,29 10.92,29 14.92,28 16.92,28 18.92,28 17.92,30 15.92,34 15.92,36 16.92,42 46.66,38.94 46.66,38.33 46.66,37.72 46.66,37.11 46.67,36.5 46.67,35.89 46.67,35.28 46.66,34.67 46.1,34.41 45.49,34.41 44.88,34.41 44.27,34.42 43.66,34.42 43.05,34.42 42.44,34.42 41.83,34.42 41.22,34.42 40.61,34.42 40,34.42 39.39,34.42 38.78,34.42 38.17,34.42 37.56,34.42 36.34,34.42 35.73,34.42 35.12,34.42 34.96,35.01 34.96,35.62 34.97,36.23 34.97,36.84 34.97,37.45 34.97,38.06 34.97,38.68 31.05,28.4
  pour Top (rank 6, no thermals): -0.05,0.02 61.38,0.02 61.38,43.97 -0.05,43.97
  pour Bottom (rank 6, no thermals): -0.08,0 61.39,0 61.39,43.33 -0.08,43.33
I2C_SCL
  Top 0.152: IC2.19 40.11,14.62 39.93,14.8 39.36,14.8 39.21,14.95 R21.1 37.93,15.83 JMP2.3
I2C_SDA  (via drill 0.35)
  Top 0.152: IC2.20 v39.31,14.15 | v39.32,16.96 39.32,17.83 R20.1 39,17.94 38.99,17.93 37.89,17.93 JMP1.3
  Bottom 0.152: v39.31,14.15 v39.31,16.95 v39.32,16.96
IN_MOSFET
  Top 0.305: MOSFET.3 3.46,21.67 H1.1
INT1  (via drill 0.35)
  Top 0.152: IC3.8 30.01,20.55 30.01,19.6 30.22,19.38 30.22,18.04 | R6.1 30.22,18.04 | 30.91,18.04 31.57,18.7 33,18.7 33.43,19.13 IC4.8 | 30.22,18.04 30.91,18.04 | 30.91,18.04 32.22,16.73 32.22,13.53 32.89,12.86 35.76,12.86 | 35.76,12.86 36.24,12.86 37.71,11.39 IC2.22 | v34.72,11.82 35.76,12.86
  Bottom 0.152: INT1.TP v34.72,11.82
INT2  (via drill 0.35)
  Top 0.152: IC4.6 31.82,21.3 31.55,21.57 29.29,21.57 29.15,21.43 IC3.6 29.15,19.83 28.82,19.5 R5.1 28.82,17.45 29.06,17.21 31.04,17.21 31.92,16.33 31.92,12.21 33.9,10.23 | IC2.25 34.46,9.08 34.22,9.32 34.22,9.92 33.9,10.23 | v33.09,10.23 33.9,10.23
  Bottom 0.152: INT2.TP 32.65,10.67 v33.09,10.23
INTF_SEL
  Top 0.152: IC3.9 30.41,20.67 30.41,21.13 30.54,21.27 31.43,21.27 31.8,20.9 34.08,20.9 | JMP3.2 37.21,21.57 36.54,20.9 34.43,20.9 34.42,20.9 34.08,20.9 | 34.08,20.9 34.08,20.89 IC4.9
LED_B
  Top 0.152: IC2.14 45.19,7.48 51.04,13.32 R17.2
LED_G
  Top 0.152: IC2.15 45.52,8.28 50.08,12.84 50.08,16.14 50.33,16.39 R18.2
LED_R  (via drill 0.35)
  Top 0.152: IC2.18 v40.91,11.93 v40.92,11.94 | v42.49,11.95 43.08,11.95 44.5,10.53 47.29,10.53 49.5,12.74 49.5,17.15 50.24,17.89 R19.2
  Bottom 0.152: v40.92,11.94 v42.48,11.94 v42.49,11.95
LORA_RXD  (via drill 0.35)
  Top 0.152: R3.1 23.57,29.24 IC1.10 v23.44,31.05 v23.43,31.05
  Bottom 0.152: v23.43,31.05 23.43,32.85 MCU_RXD.TP
LORA_TXD  (via drill 0.35)
  Top 0.152: R4.1 21.91,29.09 IC1.9 v22.19,31.03 v22.18,31.03
  Bottom 0.152: v22.18,31.03 22.18,31.75 MCU_TXD.TP
MCU_RXD  (via drill 0.35)
  Top 0.152: IC2.9 41.79,3.48 v41.12,4.14 | v24.85,24.57 24.58,24.84 R3.2
  Bottom 0.152: v41.12,4.14 40.93,4.33 40.93,4.62 36.64,8.91 36.64,12.35 36.08,12.91 33.19,12.91 32.48,13.62 32.48,17.85 31.62,18.71 28.6,18.71 24.85,22.45 v24.85,24.57
MCU_SWCLK  (via drill 0.35)
  Top 0.152: IC2.24 36.11,9.44 36.61,8.95 39.18,8.95 v39.47,8.65
  Bottom 0.152: v39.47,8.65 40.15,8.65 40.45,8.95 41.42,8.95 43.5,11.02 43.5,18.45 43,18.95 43,19.44 JP1.5
MCU_SWDIO  (via drill 0.35)
  Top 0.152: IC2.23 36.92,9.68 37.35,9.25 v39.93,9.25
  Bottom 0.152: v39.93,9.25 41.29,9.25 43.19,11.15 43.19,18.32 42.67,18.84 42.67,22.17 43.27,22.77 JP1.3
MCU_TXD  (via drill 0.35)
  Top 0.152: IC2.8 41.69,2.06 41.69,2.84 40.52,4.01 40.52,4.26 v40.24,4.54 | v20.63,24.86 R4.2
  Bottom 0.152: v40.24,4.54 40.02,4.76 40.02,5.1 36.33,8.79 36.33,12.2 35.92,12.61 33.06,12.61 32.17,13.5 32.17,17.7 31.48,18.4 28.47,18.4 24.43,22.44 24.43,23.99 23.56,24.86 v20.63,24.86
MD_RST  (via drill 0.35)
  Top 0.152: IC2.21 v38.51,11.96 | v34.64,25.93 34.95,25.93 TRANSISTOR.B
  Bottom 0.152: v38.51,11.96 38.51,12.66 38.76,12.91 38.76,13.65 38.09,14.32 38.09,17.91 36.66,19.34 36.66,24.35 35.08,25.93 v34.64,25.93
NRST  (via drill 0.35)
  Top 0.152: IC2.4 v38.51,0.78 | C21.1 v47.58,22.65 v47.58,22.66
  Bottom 0.152: v38.51,0.78 41.73,0.78 43.8,2.85 43.8,18.46 45.04,19.7 45.04,21.63 46.17,22.76 JP1.4 47.48,22.76 v47.58,22.66
OSC32_IN
  Top 0.254: IC2.2 36.91,1.18 36.64,0.91 35.31,0.91 33.49,2.74 33,2.74 | 33,2.74 CRISTAL.2 | C11.1 32.99,2.72 33,2.74
OSC32_OUT
  Top 0.254: IC2.3 37.72,1.18 37.05,0.5 35.04,0.5 34.25,1.29 CRISTAL.1 32.53,1.35 C10.1
OUT_ANT
  Top 0.76: R1.1 C1.1 arc90 33.71,33.36 33.71,32.62 arc-90 32.71,31.62 IC1.15
R11  (via drill 0.35)
  Top 0.152: R11.1 v29.67,4.74 | v20.44,17.72 IC6.7
  Bottom 0.152: v29.67,4.74 29.67,5.37 28.74,6.31 28.74,8.07 29.02,8.36 29.02,10.36 29.22,10.56 29.22,12.71 24.03,17.9 20.63,17.9 v20.44,17.72
R12  (via drill 0.35)
  Top 0.152: R12.1 v29.63,6.12 | v18.71,16.83 18.73,16.83 18.73,16.04 18.99,15.78 19.79,15.78 19.84,15.83 IC6.10
  Bottom 0.152: v29.63,6.12 29.63,6.75 29.04,7.34 29.04,7.95 29.33,8.23 29.33,10.23 29.52,10.43 29.52,12.84 24.14,18.22 20.11,18.22 v18.71,16.83
R13  (via drill 0.35)
  Top 0.152: R13.1 29.63,7.55 v29.63,7.57 | v19.06,17.89 19.34,17.61 19.34,17.1 19.71,16.73 IC6.8
  Bottom 0.152: v19.06,17.89 19.73,18.55 24.24,18.55 29.83,12.96 29.83,10.31 29.63,10.11 v29.63,7.57
R14  (via drill 0.35)
  Top 0.152: v30.13,9.9 30.13,9.35 R14.1 | v18.2,15.38 IC6.11
  Bottom 0.152: v30.13,9.9 30.13,13.09 24.36,18.86 19.32,18.86 18.21,17.75 v18.21,15.39 v18.2,15.38
R17
  Top 0.152: R17.1 55.42,14.88 RGB.6
R18
  Top 0.152: R18.1 52.95,16.18 55.58,16.18 RGB.5
R19
  Top 0.152: R19.1 52.84,17.89 53.46,17.28 55.53,17.28 RGB.4
RESET#  (via drill 0.35)
  Top 0.152: v24.16,15.6 24.16,15.69
  Top 0.254: IC6.2 24.01,15.38 24.16,15.53 v24.16,15.6 | IC6.3 24.02,15.83 24.16,15.69 24.16,15.61 24.93,15.61 C14.1 | IC6.9 v19.33,16.28 v19.32,16.28
  Bottom 0.254: v19.32,16.28 21.78,16.28 22.23,15.83 24,15.83 24.01,15.84 24.16,15.69 v24.16,15.6
SCL/SCLK  (via drill 0.35)
  Top 0.152: JMP2.2 v36.03,14.35 | IC4.5 32.28,21.98 v31.72,22.54 | v28.61,22.56 IC3.5
  Bottom 0.152: v36.03,14.35 36.03,16.72 33.45,19.3 33.45,21.2 32.11,22.54 v31.72,22.54 31.7,22.56 v28.61,22.56 28.61,24.92 24.68,28.85 SCL/SCLK.TP
SDA/MOSI  (via drill 0.35)
  Top 0.152: JMP1.2 36.04,18.42 v35.4,19.06 | IC4.4 32.41,23.1 v32.08,23.43 31.61,23.43 31.1,22.93 31.1,21.99 30.99,21.89 29.64,21.89 29.55,21.98 IC3.4
  Bottom 0.152: v35.4,19.06 34.12,19.06 33.75,19.43 33.75,21.33 32.08,23 | 32.08,23 32.08,23.35 | 32.08,23.35 v32.08,23.43 | SDA/MOSI.TP 25.82,28.14 28.92,25.05 28.92,24.14 29.9,23.16 31.86,23.16 31.87,23.17 31.89,23.16 31.91,23.18 | 32.08,23.35 31.91,23.18 | 31.91,23.18 32.08,23
SEND_OUT
  Top 0.152: IC2.7 40.91,1.17 41.16,0.93 43.91,0.93 44.22,1.24 44.22,2 44.75,2.53 44.75,3.21 IC5.2
SPI_CS  (via drill 0.35)
  Top 0.152: IC2.10 v41.88,4.28 v41.87,4.28 | v32.78,19.2 IC4.7 | IC3.7 v29.55,19.21
  Top 0.254: v32.78,19.2
  Bottom 0.152: v41.87,4.28 41.7,4.28 36.94,9.04 36.94,12.52 36.24,13.22 33.31,13.22 32.78,13.75 v32.78,19.2 v29.56,19.2 v29.55,19.21 29.26,19.21 28.02,20.45 SPI_CS.TP
SPI_MISO  (via drill 0.35)
  Top 0.152: IC2.12 v41.88,5.88 v41.87,5.88 | v33.44,24.2 33.44,23.11 IC4.3 | v30.71,24.71 R7.2 29.84,24.63 29.84,24.13 29.95,24.03 IC3.3
  Bottom 0.152: v41.87,5.88 40.97,5.88 37.55,9.29 37.55,17.73 36.08,19.2 36.08,23.32 35.2,24.2 v33.44,24.2 32.93,24.71 v30.71,24.71 30.64,24.64 29.79,24.64 26.9,27.53 SPI_MISO.TP
SPI_MOSI  (via drill 0.35)
  Top 0.152: JMP1.1 33.7,17.78 33.37,17.45 33.37,13.86 33.79,13.44 v38.05,13.44 v38.06,13.44 | IC2.13 v41.88,6.68 v41.87,6.68
  Bottom 0.152: v41.87,6.68 40.6,6.68 37.86,9.42 37.86,13.24 v38.06,13.44
SPI_SCLK  (via drill 0.35)
  Top 0.152: IC2.11 v41.88,5.08 v41.87,5.07 | v34.33,13.97 JMP2.1
  Bottom 0.152: v41.87,5.07 41.34,5.07 37.25,9.17 37.25,12.69 36.3,13.63 34.55,13.63 34.33,13.85 v34.33,13.97
SWCLK  (via drill 0.35)
  Top 0.152: IC1.4 v16.87,35.37
  Bottom 0.152: v16.87,35.37 17.22,35.72 SWCLK.TP
SWDIO  (via drill 0.35)
  Top 0.152: IC1.3 18.99,36.93 v20.8,36.93
  Bottom 0.152: SWDIO.TP 21.03,38.75 21.03,37.15 v20.8,36.93
U1_CTS
  Top 0.152: R13.2 32.31,7.48 IC2.27
U1_RTS
  Top 0.152: IC2.26 33.65,8.28 32.97,8.95 R14.2
U1_RXD
  Top 0.152: R11.2 33.28,4.74 33.61,5.07 IC2.30
U1_TXD
  Top 0.152: R12.2 33.28,6.12 33.52,5.88 IC2.29
USB_N
  Top 0.152: IC7.4 22.76,11.21 22.6,11.38 R10.1 22.63,11.63 C13.1
USB_P
  Top 0.152: IC7.6 20.86,11.47 R9.1 20.98,11.6 C12.1
USBC_N  (via drill 0.3)
  Top 0.152: USB-C.A7 21.54,2.96 21.14,3.36 v21.1,3.36 | v22.51,3.36 22.44,3.36 22.05,3.75 USB-C.B7 22.05,4.96 21.95,5.05 21.95,5.55 22.76,6.36 IC7.3
  Bottom 0.152: v21.1,3.36 v22.51,3.36
USBC_P
  Top 0.152: USB-C.A6 22.05,3.15 21.55,3.65 USB-C.B6 21.55,4.96 21.65,5.05 21.65,5.56 20.86,6.34 IC7.1
USBDM
  Top 0.152: IC6.1 23.34,14.64 22.76,14.06 22.76,13.73 22.6,13.57 R10.2
USBDP
  Top 0.152: IC6.12 20.44,14.57 20.94,14.08 20.94,13.34 R9.2
VBUS
  Top 0.305: USB-C.B4 20.55,3.62 20.52,3.6 20.52,3.12 20.55,3.09 USB-C.A9 20.55,1.24 20.93,0.85 22.66,0.85 23.04,1.24 23.04,2.48 USB-C.A4 23.05,3.07 23.09,3.12 23.09,3.6 23.05,3.64 USB-C.B9 23.05,6.05 23.42,6.42 23.42,8.13 | 23.09,8.45 22.3,8.45 21.81,8.94 IC7.5 | 23.09,8.45 23.42,8.13 | 23.09,8.45 23.75,8.45 | 23.75,8.45 24.8,8.45 25.54,9.19 C15.1 25.54,10.81 26.22,11.5 26.57,11.5 L1.1 | 23.42,8.13 23.75,8.45
VCC
  Top 0.254: IC6.4 25.84,16.28 26.59,15.54 26.59,13.48 | L1.2 28.33,13.47 | C16.1 C17.1
  Top 0.305: L1.2 26.59,13.48 | 28.33,13.47 C16.1 | C17.1

### Text on the board
tPlace: Santiago CT / Anthony JG | C:/Users/Scort/Downloads/Logotipo-Escuela-Colombiana-de-Ingeniería-Julio-Garavito-1.bmp | +3V3 | X | SWDIO | NRST | SWCLK | GND
bPlace: OH / NO